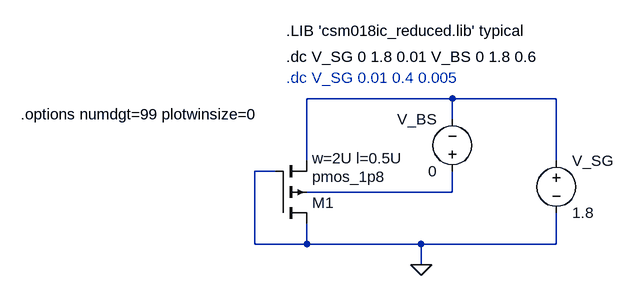
[diagram p0: schematic pmos_id_vsg.asc]
pmos_id_vsg.asc, the LTspice schematic file:
Version 4
SHEET 1 880 680
WIRE 512 128 288 128
WIRE 672 128 512 128
WIRE 512 160 512 128
WIRE 288 224 288 128
WIRE 672 224 672 128
WIRE 240 240 208 240
WIRE 512 272 512 240
WIRE 512 272 288 272
WIRE 208 352 208 240
WIRE 288 352 288 320
WIRE 288 352 208 352
WIRE 464 352 288 352
WIRE 672 352 672 304
WIRE 672 352 464 352
WIRE 464 384 464 352
FLAG 464 384 0
SYMBOL voltage 672 208 R0
SYMATTR InstName V_SG
SYMATTR Value 1.8
SYMBOL voltage 512 256 R180
WINDOW 0 24 96 Left 2
WINDOW 3 24 16 Left 2
WINDOW 123 0 0 Left 0
WINDOW 39 0 0 Left 0
SYMATTR InstName V_BS
SYMATTR Value 0
SYMBOL pmos4 240 320 M180
WINDOW 123 56 100 Left 2
SYMATTR Value2 w=2U l=0.5U
SYMATTR InstName M1
SYMATTR Value pmos_1p8
TEXT 256 24 Left 2 !.LIB 'csm018ic_reduced.lib' typical
TEXT 256 64 Left 2 !.dc V_SG 0 1.8 0.01 V_BS 0 1.8 0.6
TEXT -152 152 Left 2 !.options numdgt=99 plotwinsize=0
TEXT 256 96 Left 2 ;.dc V_SG 0.01 0.4 0.005

The netlist it stands for:
* pmos_id_vsg.asc
V_SG N001 0 1.8
V_BS N002 N001 0
M1 0 0 N001 N002 pmos_1p8 w=2U l=0.5U
.model NMOS NMOS
.model PMOS PMOS
.lib standard.mos
.LIB 'csm018ic_reduced.lib' typical
.dc V_SG 0 1.8 0.01 V_BS 0 1.8 0.6
.options numdgt=99 plotwinsize=0
* .dc V_SG 0.01 0.4 0.005
.backanno
.end